# EAGLE design ArrayC_v3zp (EAGLE 7.5.0)
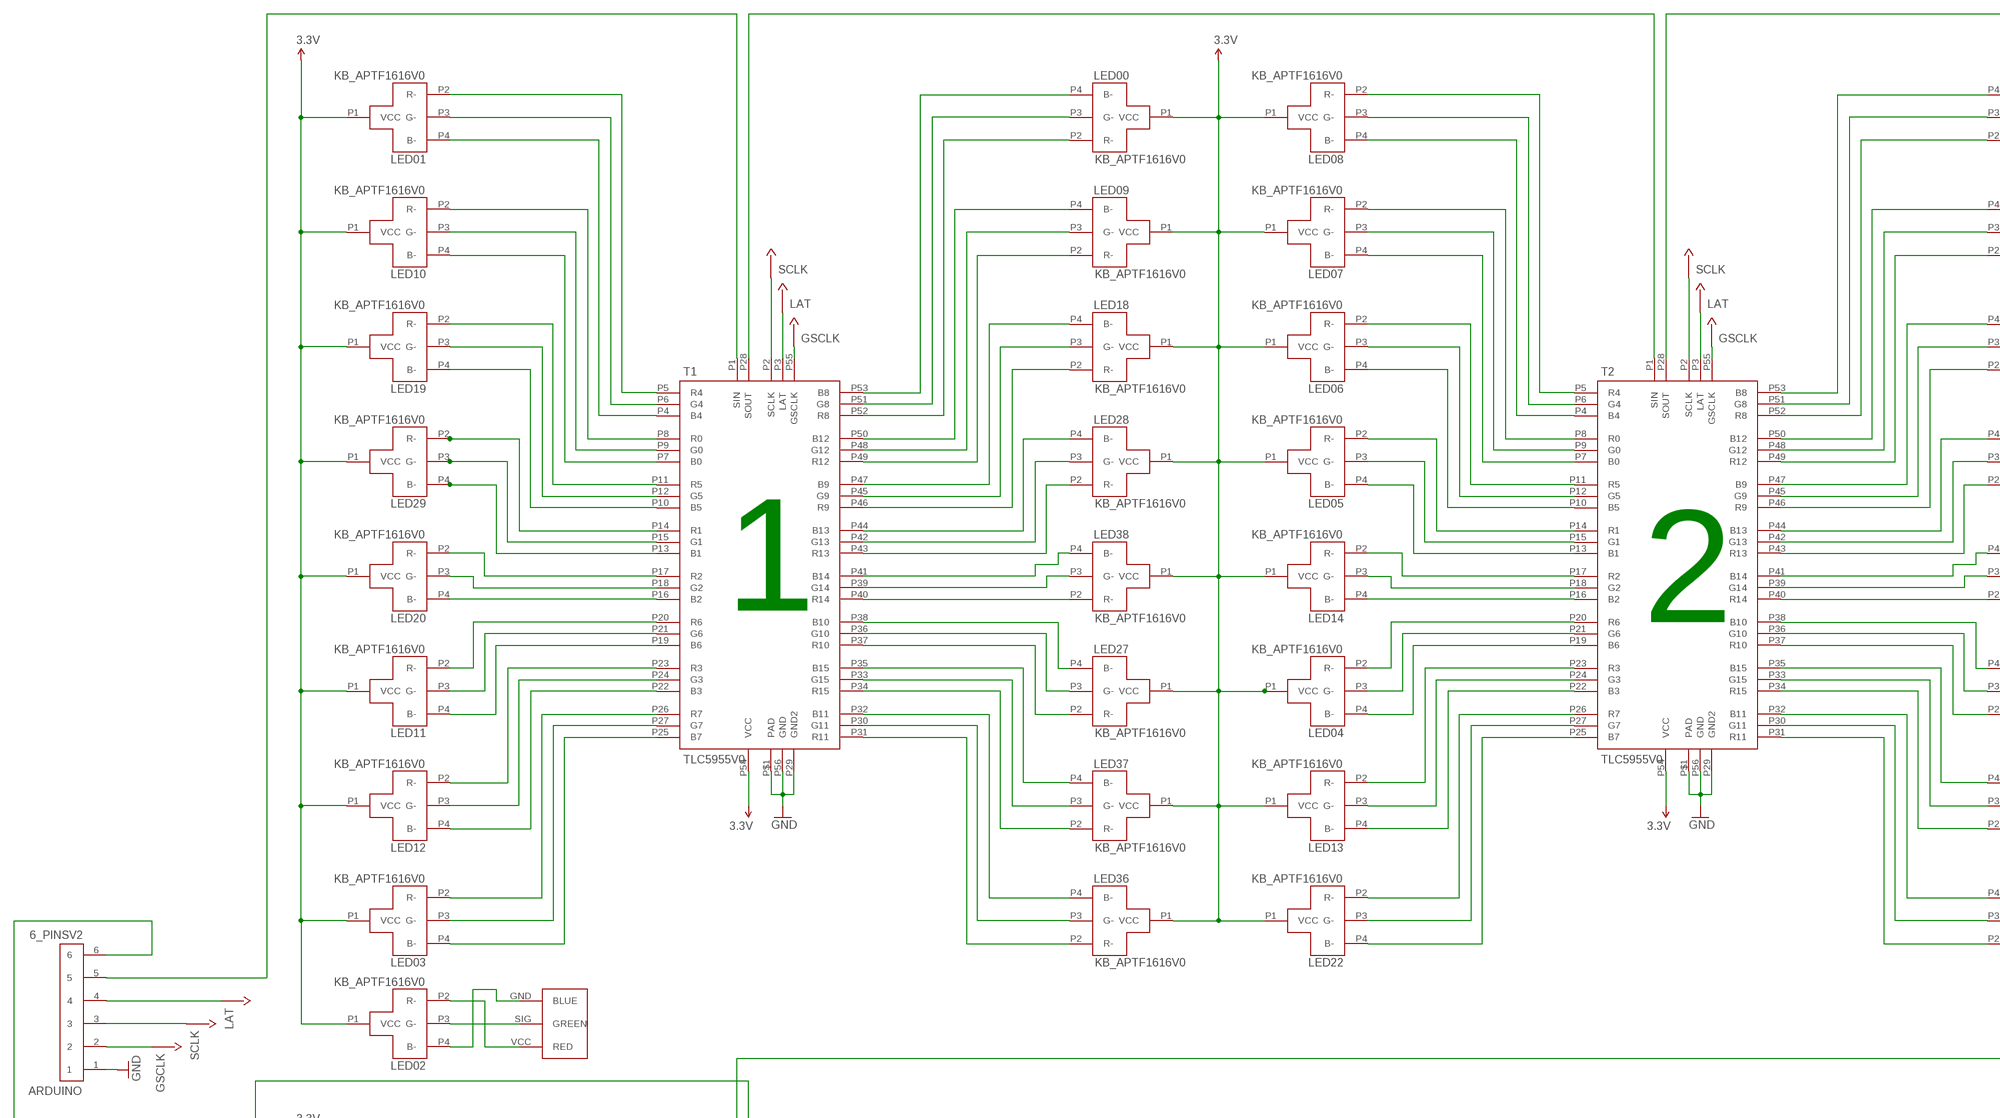
[diagram p0: schematic, sheet 1, part 1 of 3]
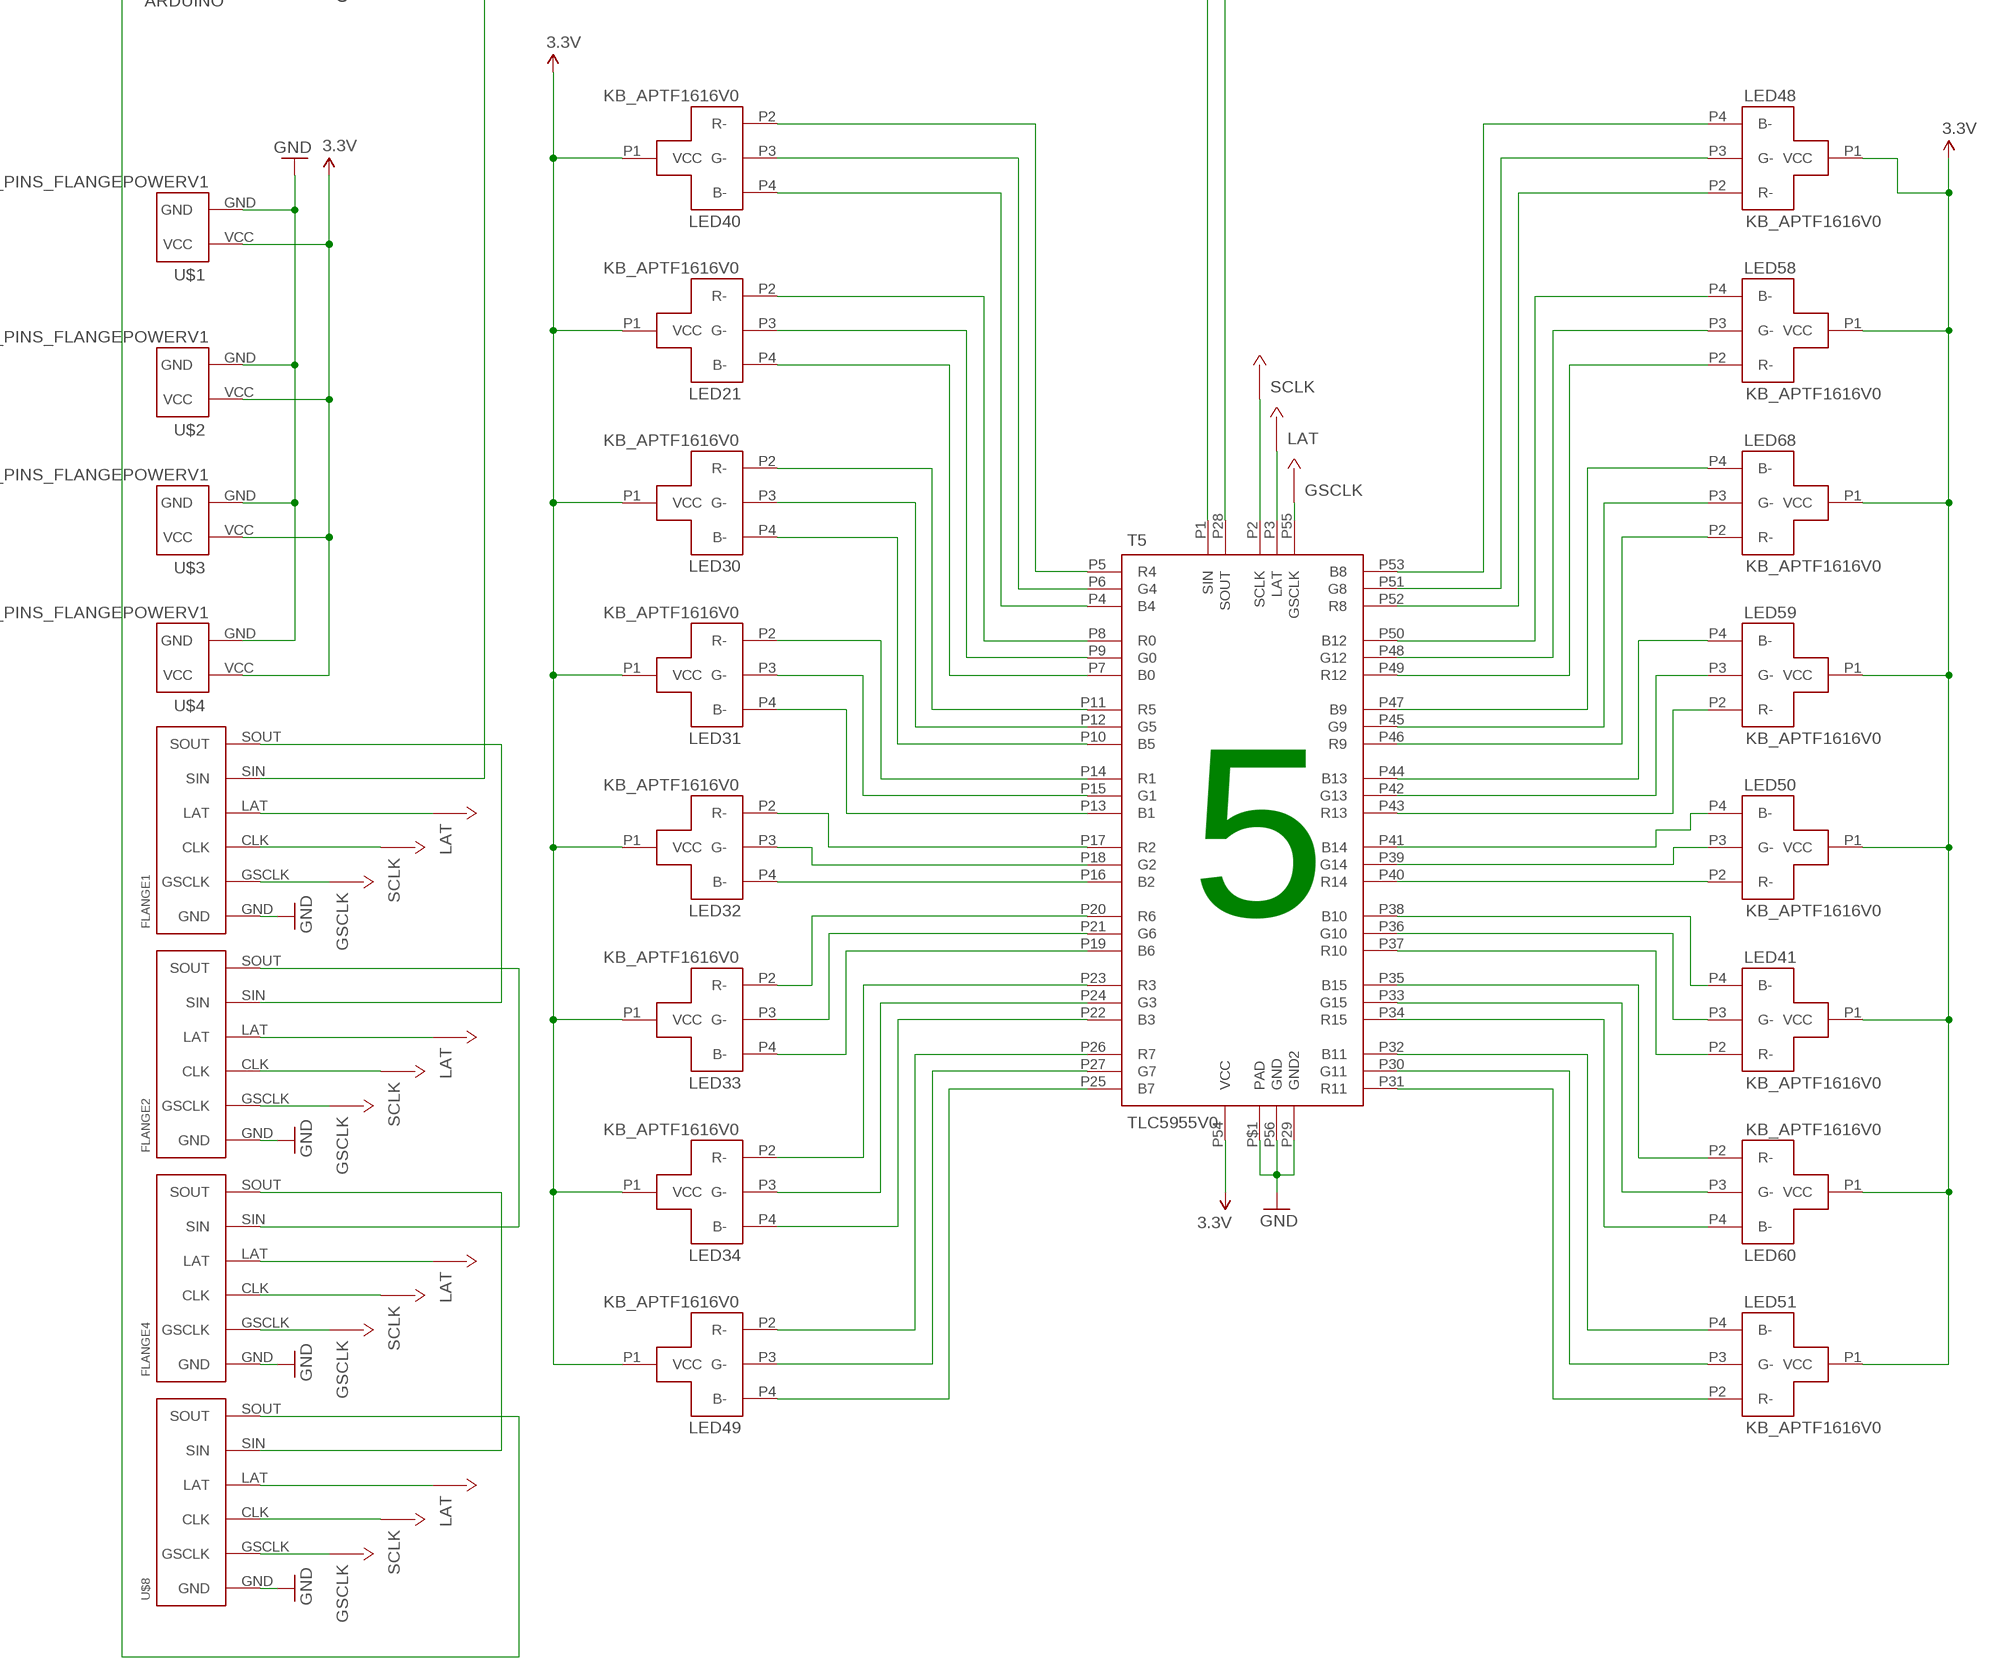
[diagram p1: schematic, sheet 1, part 2 of 3]
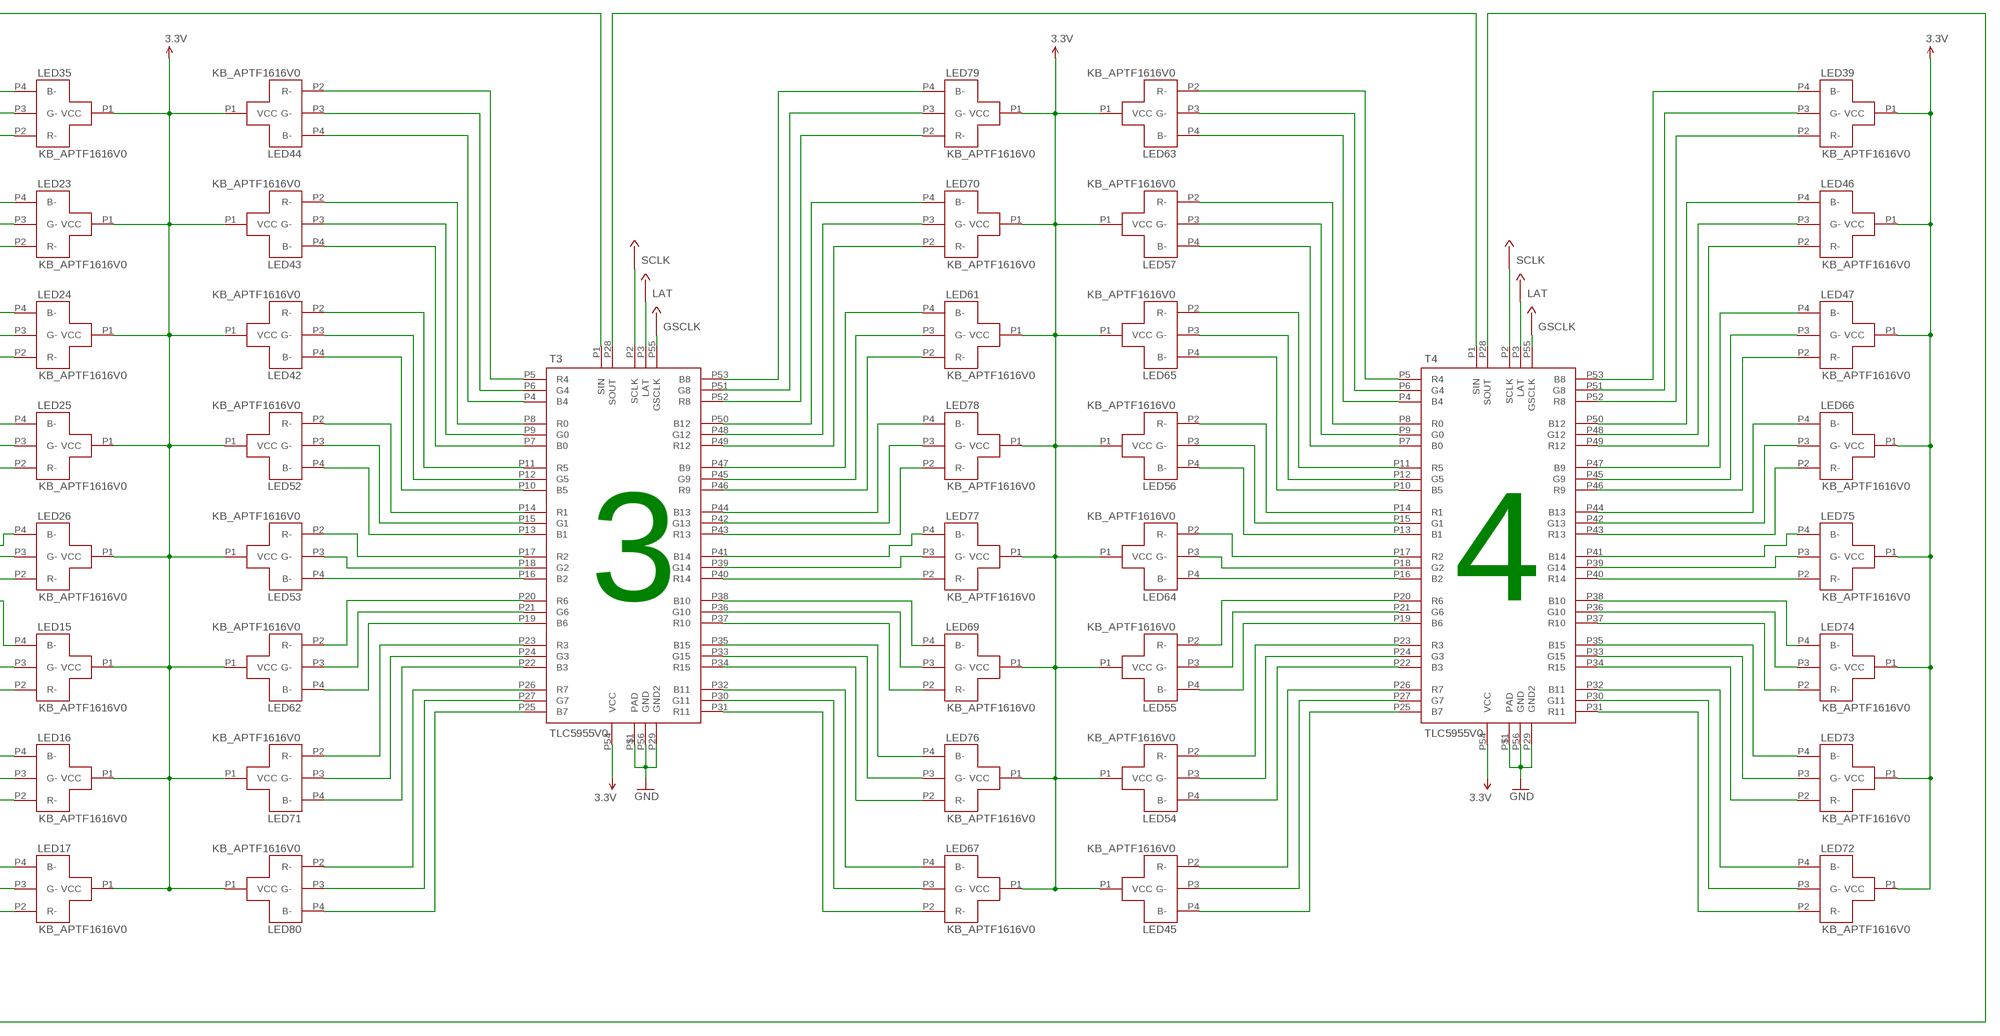
[diagram p2: schematic, sheet 1, part 3 of 3]

## Parts
ARDUINO  6_PINSV2  [6PIN_SMD]
FLANGE1  6PINS_LEDFLANGEV1  [6PIN_PADS]
FLANGE2  6PINS_LEDFLANGEV1  [6PIN_PADS]
FLANGE4  6PINS_LEDFLANGEV1  [6PIN_PADS]
LED  3_PINS_RGBV1  [3PIN_HOLES]
LED00  KB_APTF1616V0  [KB_RGBLED_APTF1616]
LED01  KB_APTF1616V0  [KB_RGBLED_APTF1616]
LED02  KB_APTF1616V0  [KB_RGBLED_APTF1616]
LED03  KB_APTF1616V0  [KB_RGBLED_APTF1616]
LED04  KB_APTF1616V0  [KB_RGBLED_APTF1616]
LED05  KB_APTF1616V0  [KB_RGBLED_APTF1616]
LED06  KB_APTF1616V0  [KB_RGBLED_APTF1616]
LED07  KB_APTF1616V0  [KB_RGBLED_APTF1616]
LED08  KB_APTF1616V0  [KB_RGBLED_APTF1616]
LED09  KB_APTF1616V0  [KB_RGBLED_APTF1616]
LED10  KB_APTF1616V0  [KB_RGBLED_APTF1616]
LED11  KB_APTF1616V0  [KB_RGBLED_APTF1616]
LED12  KB_APTF1616V0  [KB_RGBLED_APTF1616]
LED13  KB_APTF1616V0  [KB_RGBLED_APTF1616]
LED14  KB_APTF1616V0  [KB_RGBLED_APTF1616]
LED15  KB_APTF1616V0  [KB_RGBLED_APTF1616]
LED16  KB_APTF1616V0  [KB_RGBLED_APTF1616]
LED17  KB_APTF1616V0  [KB_RGBLED_APTF1616]
LED18  KB_APTF1616V0  [KB_RGBLED_APTF1616]
LED19  KB_APTF1616V0  [KB_RGBLED_APTF1616]
LED20  KB_APTF1616V0  [KB_RGBLED_APTF1616]
LED21  KB_APTF1616V0  [KB_RGBLED_APTF1616]
LED22  KB_APTF1616V0  [KB_RGBLED_APTF1616]
LED23  KB_APTF1616V0  [KB_RGBLED_APTF1616]
LED24  KB_APTF1616V0  [KB_RGBLED_APTF1616]
LED25  KB_APTF1616V0  [KB_RGBLED_APTF1616]
LED26  KB_APTF1616V0  [KB_RGBLED_APTF1616]
LED27  KB_APTF1616V0  [KB_RGBLED_APTF1616]
LED28  KB_APTF1616V0  [KB_RGBLED_APTF1616]
LED29  KB_APTF1616V0  [KB_RGBLED_APTF1616]
LED30  KB_APTF1616V0  [KB_RGBLED_APTF1616]
LED31  KB_APTF1616V0  [KB_RGBLED_APTF1616]
LED32  KB_APTF1616V0  [KB_RGBLED_APTF1616]
LED33  KB_APTF1616V0  [KB_RGBLED_APTF1616]
LED34  KB_APTF1616V0  [KB_RGBLED_APTF1616]
LED35  KB_APTF1616V0  [KB_RGBLED_APTF1616]
LED36  KB_APTF1616V0  [KB_RGBLED_APTF1616]
LED37  KB_APTF1616V0  [KB_RGBLED_APTF1616]
LED38  KB_APTF1616V0  [KB_RGBLED_APTF1616]
LED39  KB_APTF1616V0  [KB_RGBLED_APTF1616]
LED40  KB_APTF1616V0  [KB_RGBLED_APTF1616]
LED41  KB_APTF1616V0  [KB_RGBLED_APTF1616]
LED42  KB_APTF1616V0  [KB_RGBLED_APTF1616]
LED43  KB_APTF1616V0  [KB_RGBLED_APTF1616]
LED44  KB_APTF1616V0  [KB_RGBLED_APTF1616]
LED45  KB_APTF1616V0  [KB_RGBLED_APTF1616]
LED46  KB_APTF1616V0  [KB_RGBLED_APTF1616]
LED47  KB_APTF1616V0  [KB_RGBLED_APTF1616]
LED48  KB_APTF1616V0  [KB_RGBLED_APTF1616]
LED49  KB_APTF1616V0  [KB_RGBLED_APTF1616]
LED50  KB_APTF1616V0  [KB_RGBLED_APTF1616]
LED51  KB_APTF1616V0  [KB_RGBLED_APTF1616]
LED52  KB_APTF1616V0  [KB_RGBLED_APTF1616]
LED53  KB_APTF1616V0  [KB_RGBLED_APTF1616]
LED54  KB_APTF1616V0  [KB_RGBLED_APTF1616]
LED55  KB_APTF1616V0  [KB_RGBLED_APTF1616]
LED56  KB_APTF1616V0  [KB_RGBLED_APTF1616]
LED57  KB_APTF1616V0  [KB_RGBLED_APTF1616]
LED58  KB_APTF1616V0  [KB_RGBLED_APTF1616]
LED59  KB_APTF1616V0  [KB_RGBLED_APTF1616]
LED60  KB_APTF1616V0  [KB_RGBLED_APTF1616]
LED61  KB_APTF1616V0  [KB_RGBLED_APTF1616]
LED62  KB_APTF1616V0  [KB_RGBLED_APTF1616]
LED63  KB_APTF1616V0  [KB_RGBLED_APTF1616]
LED64  KB_APTF1616V0  [KB_RGBLED_APTF1616]
LED65  KB_APTF1616V0  [KB_RGBLED_APTF1616]
LED66  KB_APTF1616V0  [KB_RGBLED_APTF1616]
LED67  KB_APTF1616V0  [KB_RGBLED_APTF1616]
LED68  KB_APTF1616V0  [KB_RGBLED_APTF1616]
LED69  KB_APTF1616V0  [KB_RGBLED_APTF1616]
LED70  KB_APTF1616V0  [KB_RGBLED_APTF1616]
LED71  KB_APTF1616V0  [KB_RGBLED_APTF1616]
LED72  KB_APTF1616V0  [KB_RGBLED_APTF1616]
LED73  KB_APTF1616V0  [KB_RGBLED_APTF1616]
LED74  KB_APTF1616V0  [KB_RGBLED_APTF1616]
LED75  KB_APTF1616V0  [KB_RGBLED_APTF1616]
LED76  KB_APTF1616V0  [KB_RGBLED_APTF1616]
LED77  KB_APTF1616V0  [KB_RGBLED_APTF1616]
LED78  KB_APTF1616V0  [KB_RGBLED_APTF1616]
LED79  KB_APTF1616V0  [KB_RGBLED_APTF1616]
LED80  KB_APTF1616V0  [KB_RGBLED_APTF1616]
T1  TLC5955V0  [56-HTSSOP]
T2  TLC5955V0  [56-HTSSOP]
T3  TLC5955V0  [56-HTSSOP]
T4  TLC5955V0  [56-HTSSOP]
T5  TLC5955V0  [56-HTSSOP]
U$1  2_PINS_FLANGEPOWERV1  [2PIN_PADS_PWR]
U$2  2_PINS_FLANGEPOWERV1  [2PIN_PADS_PWR]
U$3  2_PINS_FLANGEPOWERV1  [2PIN_PADS_PWR]
U$4  2_PINS_FLANGEPOWERV1  [2PIN_PADS_PWR]
U$8  6PINS_LEDFLANGEV1  [6PIN_PADS]

## Nets
3.3V: LED01.P1(VCC) LED02.P1(VCC) LED03.P1(VCC) LED10.P1(VCC) LED11.P1(VCC) LED12.P1(VCC) LED19.P1(VCC) LED20.P1(VCC) LED21.P1(VCC) LED29.P1(VCC) LED30.P1(VCC) LED31.P1(VCC) LED32.P1(VCC) LED33.P1(VCC) LED34.P1(VCC) LED39.P1(VCC) LED40.P1(VCC) LED41.P1(VCC) LED45.P1(VCC) LED46.P1(VCC) LED47.P1(VCC) LED48.P1(VCC) LED49.P1(VCC) LED50.P1(VCC) LED51.P1(VCC) LED54.P1(VCC) LED55.P1(VCC) LED56.P1(VCC) LED57.P1(VCC) LED58.P1(VCC) LED59.P1(VCC) LED60.P1(VCC) LED61.P1(VCC) LED63.P1(VCC) LED64.P1(VCC) LED65.P1(VCC) LED66.P1(VCC) LED67.P1(VCC) LED68.P1(VCC) LED69.P1(VCC) LED70.P1(VCC) LED72.P1(VCC) LED73.P1(VCC) LED74.P1(VCC) LED75.P1(VCC) LED76.P1(VCC) LED77.P1(VCC) LED78.P1(VCC) LED79.P1(VCC) T1.P54(VCC) T2.P54(VCC) T3.P54(VCC) T4.P54(VCC) T5.P54(VCC) U$1.VCC U$2.VCC U$3.VCC U$4.VCC
GND: ARDUINO.1 FLANGE1.GND FLANGE2.GND FLANGE4.GND T1.P29(GND2) T1.P56(GND) T1.P$1(PAD) T2.P29(GND2) T2.P56(GND) T2.P$1(PAD) T3.P29(GND2) T3.P56(GND) T3.P$1(PAD) T4.P29(GND2) T4.P56(GND) T4.P$1(PAD) T5.P29(GND2) T5.P56(GND) T5.P$1(PAD) U$1.GND U$2.GND U$3.GND U$4.GND U$8.GND
GSCLK: ARDUINO.2 FLANGE1.GSCLK FLANGE2.GSCLK FLANGE4.GSCLK T1.P55(GSCLK) T2.P55(GSCLK) T3.P55(GSCLK) T4.P55(GSCLK) T5.P55(GSCLK) U$8.GSCLK
LAT: ARDUINO.4 FLANGE1.LAT FLANGE2.LAT FLANGE4.LAT T1.P3(LAT) T2.P3(LAT) T3.P3(LAT) T4.P3(LAT) T5.P3(LAT) U$8.LAT
N$1: LED40.P2(R-) T5.P5(R4)
N$2: LED40.P3(G-) T5.P6(G4)
N$3: LED40.P4(B-) T5.P4(B4)
N$4: LED21.P2(R-) T5.P8(R0)
N$5: LED21.P3(G-) T5.P9(G0)
N$6: LED21.P4(B-) T5.P7(B0)
N$7: LED30.P2(R-) T5.P11(R5)
N$8: LED30.P3(G-) T5.P12(G5)
N$9: LED30.P4(B-) T5.P10(B5)
N$10: LED31.P2(R-) T5.P14(R1)
N$11: LED31.P3(G-) T5.P15(G1)
N$12: LED31.P4(B-) T5.P13(B1)
N$13: LED32.P2(R-) T5.P17(R2)
N$14: LED32.P3(G-) T5.P18(G2)
N$15: LED32.P4(B-) T5.P16(B2)
N$16: LED33.P2(R-) T5.P20(R6)
N$17: LED33.P3(G-) T5.P21(G6)
N$18: LED33.P4(B-) T5.P19(B6)
N$19: LED34.P2(R-) T5.P23(R3)
N$20: LED34.P3(G-) T5.P24(G3)
N$21: LED34.P4(B-) T5.P22(B3)
N$22: LED49.P2(R-) T5.P26(R7)
N$23: LED49.P3(G-) T5.P27(G7)
N$24: LED49.P4(B-) T5.P25(B7)
N$25: LED48.P4(B-) T5.P53(B8)
N$26: LED48.P3(G-) T5.P51(G8)
N$27: LED48.P2(R-) T5.P52(R8)
N$28: LED58.P4(B-) T5.P50(B12)
N$29: LED58.P3(G-) T5.P48(G12)
N$30: LED58.P2(R-) T5.P49(R12)
N$31: LED68.P4(B-) T5.P47(B9)
N$32: LED68.P3(G-) T5.P45(G9)
N$33: LED68.P2(R-) T5.P46(R9)
N$34: LED59.P4(B-) T5.P44(B13)
N$35: LED59.P3(G-) T5.P42(G13)
N$36: LED50.P4(B-) T5.P41(B14)
N$37: LED50.P3(G-) T5.P39(G14)
N$38: LED50.P2(R-) T5.P40(R14)
N$39: LED41.P4(B-) T5.P38(B10)
N$40: LED41.P3(G-) T5.P36(G10)
N$41: LED41.P2(R-) T5.P37(R10)
N$42: LED60.P2(R-) T5.P35(B15)
N$43: LED60.P3(G-) T5.P33(G15)
N$44: LED60.P4(B-) T5.P34(R15)
N$45: LED51.P4(B-) T5.P32(B11)
N$46: LED51.P3(G-) T5.P30(G11)
N$47: LED51.P2(R-) T5.P31(R11)
N$49: LED02.P2(R-) LED.VCC(RED)
N$50: LED02.P4(B-) LED.GND(BLUE)
N$51: LED02.P3(G-) LED.SIG(GREEN)
N$52: FLANGE1.SOUT FLANGE2.SIN
N$53: FLANGE2.SOUT FLANGE4.SIN
N$54: ARDUINO.6 U$8.SOUT
N$55: FLANGE4.SOUT U$8.SIN
N$95: LED01.P2(R-) T1.P5(R4)
N$96: LED01.P3(G-) T1.P6(G4)
N$97: LED01.P4(B-) T1.P4(B4)
N$98: LED10.P2(R-) T1.P8(R0)
N$99: LED10.P3(G-) T1.P9(G0)
N$100: LED10.P4(B-) T1.P7(B0)
N$101: LED19.P2(R-) T1.P11(R5)
N$102: LED19.P3(G-) T1.P12(G5)
N$103: LED19.P4(B-) T1.P10(B5)
N$104: LED29.P2(R-) T1.P14(R1)
N$105: LED29.P3(G-) T1.P15(G1)
N$106: LED29.P4(B-) T1.P13(B1)
N$107: LED20.P2(R-) T1.P17(R2)
N$108: LED20.P3(G-) T1.P18(G2)
N$109: LED20.P4(B-) T1.P16(B2)
N$110: LED11.P2(R-) T1.P20(R6)
N$111: LED11.P3(G-) T1.P21(G6)
N$112: LED11.P4(B-) T1.P19(B6)
N$113: LED12.P2(R-) T1.P23(R3)
N$114: LED12.P3(G-) T1.P24(G3)
N$115: LED12.P4(B-) T1.P22(B3)
N$116: LED03.P2(R-) T1.P26(R7)
N$117: LED03.P3(G-) T1.P27(G7)
N$118: LED03.P4(B-) T1.P25(B7)
N$119: LED00.P4(B-) T1.P53(B8)
N$120: LED00.P3(G-) T1.P51(G8)
N$121: LED00.P2(R-) T1.P52(R8)
N$122: LED09.P4(B-) T1.P50(B12)
N$123: LED09.P3(G-) T1.P48(G12)
N$124: LED09.P2(R-) T1.P49(R12)
N$125: LED18.P4(B-) T1.P47(B9)
N$126: LED18.P3(G-) T1.P45(G9)
N$127: LED18.P2(R-) T1.P46(R9)
N$128: LED28.P4(B-) T1.P44(B13)
N$129: LED28.P3(G-) T1.P42(G13)
N$130: LED38.P4(B-) T1.P41(B14)
N$131: LED38.P3(G-) T1.P39(G14)
N$132: LED38.P2(R-) T1.P40(R14)
N$133: LED27.P4(B-) T1.P38(B10)
N$134: LED27.P3(G-) T1.P36(G10)
N$135: LED27.P2(R-) T1.P37(R10)
N$136: LED37.P4(B-) T1.P35(B15)
N$137: LED37.P3(G-) T1.P33(G15)
N$138: LED37.P2(R-) T1.P34(R15)
N$139: LED36.P4(B-) T1.P32(B11)
N$140: LED36.P3(G-) T1.P30(G11)
N$141: LED36.P2(R-) T1.P31(R11)
N$142: LED44.P2(R-) T3.P5(R4)
N$143: LED08.P2(R-) T2.P5(R4)
N$144: LED08.P3(G-) T2.P6(G4)
N$145: LED08.P4(B-) T2.P4(B4)
N$146: LED07.P2(R-) T2.P8(R0)
N$147: LED07.P3(G-) T2.P9(G0)
N$148: LED07.P4(B-) T2.P7(B0)
N$149: LED06.P2(R-) T2.P11(R5)
N$150: LED06.P3(G-) T2.P12(G5)
N$151: LED06.P4(B-) T2.P10(B5)
N$152: LED05.P2(R-) T2.P14(R1)
N$153: LED05.P3(G-) T2.P15(G1)
N$154: LED05.P4(B-) T2.P13(B1)
N$155: LED14.P2(R-) T2.P17(R2)
N$156: LED14.P3(G-) T2.P18(G2)
N$157: LED14.P4(B-) T2.P16(B2)
N$158: LED04.P2(R-) T2.P20(R6)
N$159: LED04.P3(G-) T2.P21(G6)
N$160: LED04.P4(B-) T2.P19(B6)
N$161: LED13.P2(R-) T2.P23(R3)
N$162: LED13.P3(G-) T2.P24(G3)
N$163: LED13.P4(B-) T2.P22(B3)
N$164: LED22.P2(R-) T2.P26(R7)
N$165: LED22.P3(G-) T2.P27(G7)
N$166: LED22.P4(B-) T2.P25(B7)
N$167: LED35.P4(B-) T2.P53(B8)
N$168: LED35.P3(G-) T2.P51(G8)
N$169: LED35.P2(R-) T2.P52(R8)
N$170: LED23.P4(B-) T2.P50(B12)
N$171: LED23.P3(G-) T2.P48(G12)
N$172: LED23.P2(R-) T2.P49(R12)
N$173: LED24.P4(B-) T2.P47(B9)
N$174: LED24.P3(G-) T2.P45(G9)
N$175: LED24.P2(R-) T2.P46(R9)
N$176: LED25.P4(B-) T2.P44(B13)
N$177: LED25.P3(G-) T2.P42(G13)
N$178: LED26.P4(B-) T2.P41(B14)
N$179: LED26.P3(G-) T2.P39(G14)
N$180: LED26.P2(R-) T2.P40(R14)
N$181: LED15.P4(B-) T2.P38(B10)
N$182: LED15.P3(G-) T2.P36(G10)
N$183: LED15.P2(R-) T2.P37(R10)
N$184: LED16.P4(B-) T2.P35(B15)
N$185: LED16.P3(G-) T2.P33(G15)
N$186: LED16.P2(R-) T2.P34(R15)
N$187: LED17.P4(B-) T2.P32(B11)
N$188: LED17.P3(G-) T2.P30(G11)
N$189: LED17.P2(R-) T2.P31(R11)
N$190: LED44.P3(G-) T3.P6(G4)
N$191: LED44.P4(B-) T3.P4(B4)
N$192: LED43.P2(R-) T3.P8(R0)
N$193: LED43.P3(G-) T3.P9(G0)
N$194: LED43.P4(B-) T3.P7(B0)
N$195: LED42.P2(R-) T3.P11(R5)
N$196: LED42.P3(G-) T3.P12(G5)
N$197: LED42.P4(B-) T3.P10(B5)
N$198: LED52.P2(R-) T3.P14(R1)
N$199: LED52.P3(G-) T3.P15(G1)
N$200: LED52.P4(B-) T3.P13(B1)
N$201: LED53.P2(R-) T3.P17(R2)
N$202: LED53.P3(G-) T3.P18(G2)
N$203: LED53.P4(B-) T3.P16(B2)
N$204: LED62.P2(R-) T3.P20(R6)
N$205: LED62.P3(G-) T3.P21(G6)
N$206: LED62.P4(B-) T3.P19(B6)
N$207: LED71.P2(R-) T3.P23(R3)
N$208: LED71.P3(G-) T3.P24(G3)
N$209: LED71.P4(B-) T3.P22(B3)
N$210: LED80.P2(R-) T3.P26(R7)
N$211: LED80.P3(G-) T3.P27(G7)
N$212: LED80.P4(B-) T3.P25(B7)
N$213: LED79.P4(B-) T3.P53(B8)
N$214: LED79.P3(G-) T3.P51(G8)
N$215: LED79.P2(R-) T3.P52(R8)
N$216: LED70.P4(B-) T3.P50(B12)
N$217: LED70.P3(G-) T3.P48(G12)
N$218: LED70.P2(R-) T3.P49(R12)
N$219: LED61.P4(B-) T3.P47(B9)
N$220: LED61.P3(G-) T3.P45(G9)
N$221: LED61.P2(R-) T3.P46(R9)
N$222: LED78.P4(B-) T3.P44(B13)
N$223: LED78.P3(G-) T3.P42(G13)
N$224: LED77.P4(B-) T3.P41(B14)
N$225: LED77.P3(G-) T3.P39(G14)
N$226: LED77.P2(R-) T3.P40(R14)
N$227: LED69.P4(B-) T3.P38(B10)
N$228: LED69.P3(G-) T3.P36(G10)
N$229: LED69.P2(R-) T3.P37(R10)
N$230: LED76.P4(B-) T3.P35(B15)
N$231: LED76.P3(G-) T3.P33(G15)
N$232: LED76.P2(R-) T3.P34(R15)
N$233: LED67.P4(B-) T3.P32(B11)
N$234: LED67.P3(G-) T3.P30(G11)
N$235: LED67.P2(R-) T3.P31(R11)
N$283: LED63.P2(R-) T4.P5(R4)
N$284: LED63.P3(G-) T4.P6(G4)
N$285: LED63.P4(B-) T4.P4(B4)
N$286: LED57.P2(R-) T4.P8(R0)
N$287: LED57.P3(G-) T4.P9(G0)
N$288: LED57.P4(B-) T4.P7(B0)
N$289: LED65.P2(R-) T4.P11(R5)
N$290: LED65.P3(G-) T4.P12(G5)
N$291: LED65.P4(B-) T4.P10(B5)
N$292: LED56.P2(R-) T4.P14(R1)
N$293: LED56.P3(G-) T4.P15(G1)
N$294: LED56.P4(B-) T4.P13(B1)
N$295: LED64.P2(R-) T4.P17(R2)
N$296: LED64.P3(G-) T4.P18(G2)
N$297: LED64.P4(B-) T4.P16(B2)
N$298: LED55.P2(R-) T4.P20(R6)
N$299: LED55.P3(G-) T4.P21(G6)
N$300: LED55.P4(B-) T4.P19(B6)
N$301: LED54.P2(R-) T4.P23(R3)
N$302: LED54.P3(G-) T4.P24(G3)
N$303: LED54.P4(B-) T4.P22(B3)
N$304: LED45.P2(R-) T4.P26(R7)
N$305: LED45.P3(G-) T4.P27(G7)
N$306: LED45.P4(B-) T4.P25(B7)
N$307: LED39.P4(B-) T4.P53(B8)
N$308: LED39.P3(G-) T4.P51(G8)
N$309: LED39.P2(R-) T4.P52(R8)
N$310: LED46.P4(B-) T4.P50(B12)
N$311: LED46.P3(G-) T4.P48(G12)
N$312: LED46.P2(R-) T4.P49(R12)
N$313: LED47.P4(B-) T4.P47(B9)
N$314: LED47.P3(G-) T4.P45(G9)
N$315: LED47.P2(R-) T4.P46(R9)
N$316: LED66.P4(B-) T4.P44(B13)
N$317: LED66.P3(G-) T4.P42(G13)
N$318: LED75.P4(B-) T4.P41(B14)
N$319: LED75.P3(G-) T4.P39(G14)
N$320: LED75.P2(R-) T4.P40(R14)
N$321: LED74.P4(B-) T4.P38(B10)
N$322: LED74.P3(G-) T4.P36(G10)
N$323: LED74.P2(R-) T4.P37(R10)
N$324: LED73.P4(B-) T4.P35(B15)
N$325: LED73.P3(G-) T4.P33(G15)
N$326: LED73.P2(R-) T4.P34(R15)
N$327: LED72.P4(B-) T4.P32(B11)
N$328: LED72.P3(G-) T4.P30(G11)
N$329: LED72.P2(R-) T4.P31(R11)
N$357: FLANGE1.SIN T5.P28(SOUT)
N$360: T4.P28(SOUT) T5.P1(SIN)
N$361: T3.P28(SOUT) T4.P1(SIN)
N$362: T2.P28(SOUT) T3.P1(SIN)
N$363: T1.P28(SOUT) T2.P1(SIN)
N$364: LED66.P2(R-) T4.P43(R13)
N$365: ARDUINO.5 T1.P1(SIN)
N$370: LED59.P2(R-) T5.P43(R13)
N$372: LED78.P2(R-) T3.P43(R13)
N$373: LED25.P2(R-) T2.P43(R13)
N$374: LED00.P1(VCC) LED04.P1(VCC) LED05.P1(VCC) LED06.P1(VCC) LED07.P1(VCC) LED08.P1(VCC) LED09.P1(VCC) LED13.P1(VCC) LED14.P1(VCC) LED18.P1(VCC) LED22.P1(VCC) LED27.P1(VCC) LED28.P1(VCC) LED36.P1(VCC) LED37.P1(VCC) LED38.P1(VCC)
N$375: LED28.P2(R-) T1.P43(R13)
N$384: LED15.P1(VCC) LED16.P1(VCC) LED17.P1(VCC) LED23.P1(VCC) LED24.P1(VCC) LED25.P1(VCC) LED26.P1(VCC) LED35.P1(VCC) LED42.P1(VCC) LED43.P1(VCC) LED44.P1(VCC) LED52.P1(VCC) LED53.P1(VCC) LED62.P1(VCC) LED71.P1(VCC) LED80.P1(VCC)
SCLK: ARDUINO.3 FLANGE1.CLK FLANGE2.CLK FLANGE4.CLK T1.P2(SCLK) T2.P2(SCLK) T3.P2(SCLK) T4.P2(SCLK) T5.P2(SCLK) U$8.CLK

## Notes on the sheet
- 1 | 2 | 3 | 4
- 5

## Library data of the parts
ARDUINO = WallerLabLib:6_PINS
FLANGE1 FLANGE2 FLANGE4 U$8 = WallerLabLib:6PINS_LEDFLANGE
LED = WallerLabLib:3_PINS_RGB
LED00 LED01-LED09 LED10-LED80 = WallerLabLib:KB_APTF1616
T1-T5 = WallerLabLib:TLC5955
U$1-U$4 = WallerLabLib:2_PINS_FLANGEPOWER

## Board
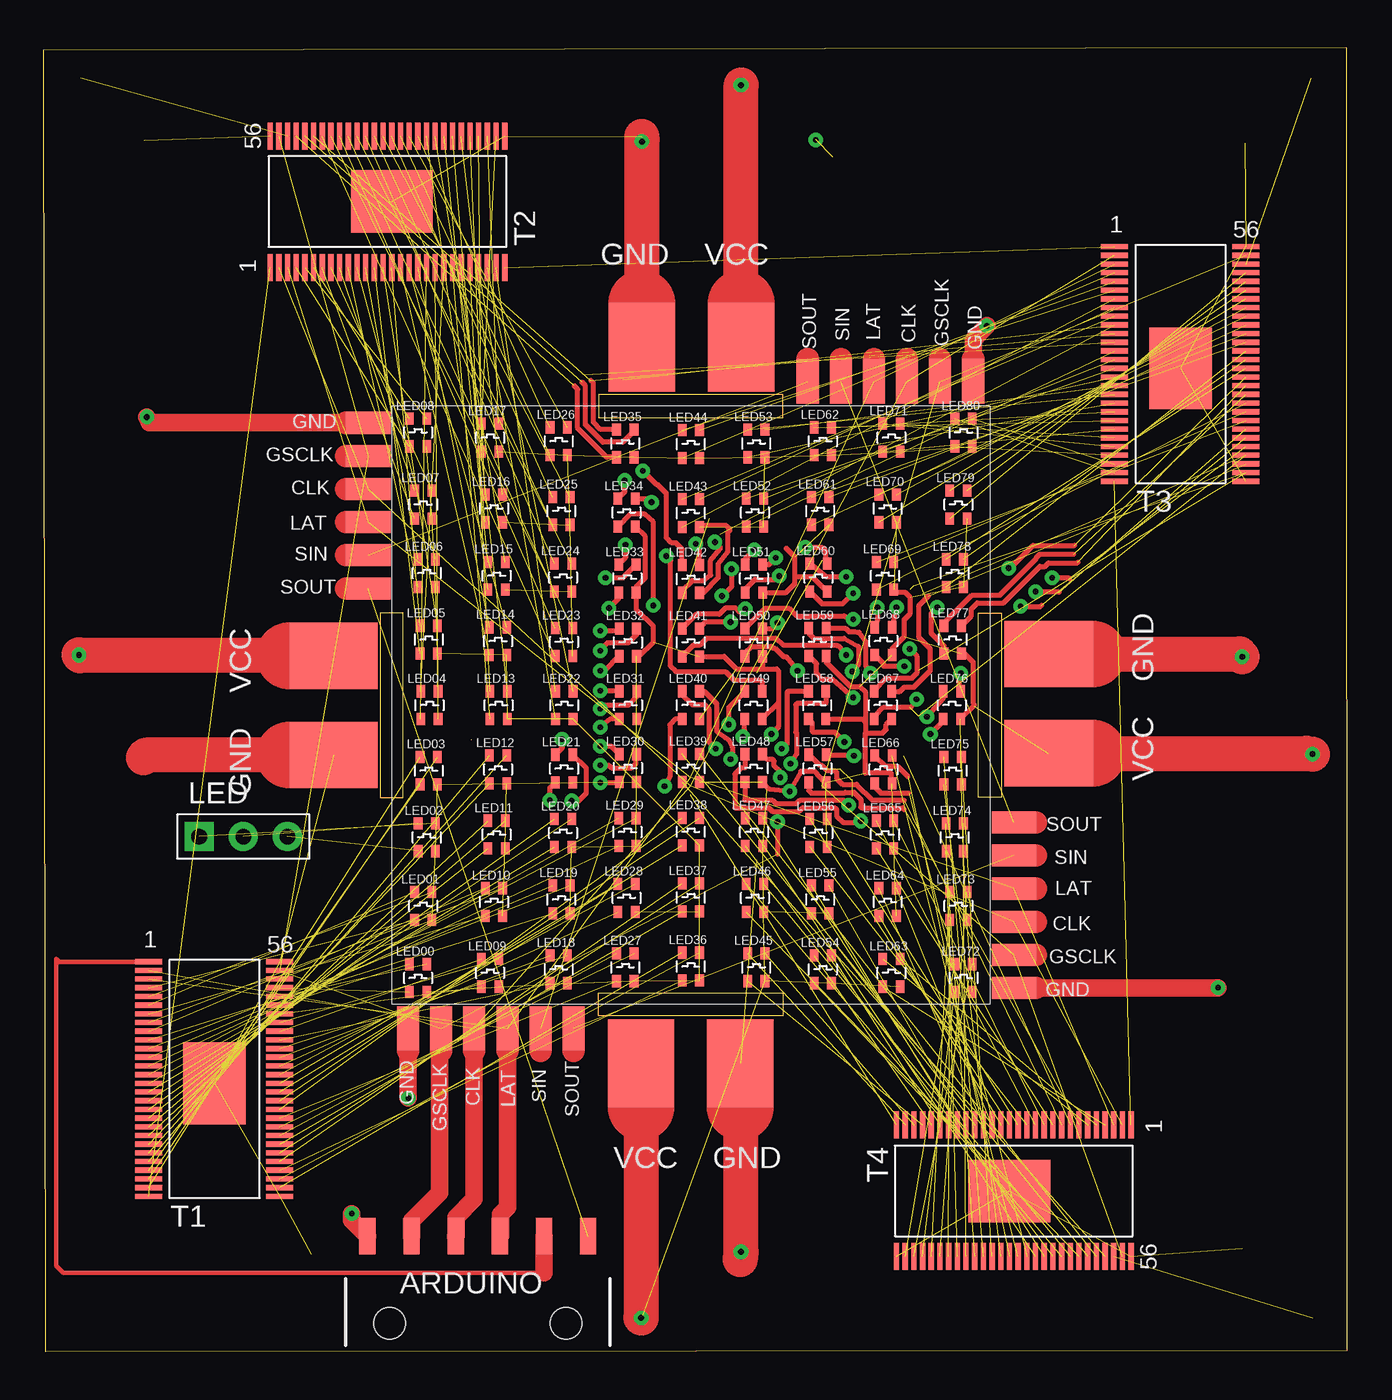
[diagram p3: board, top side]
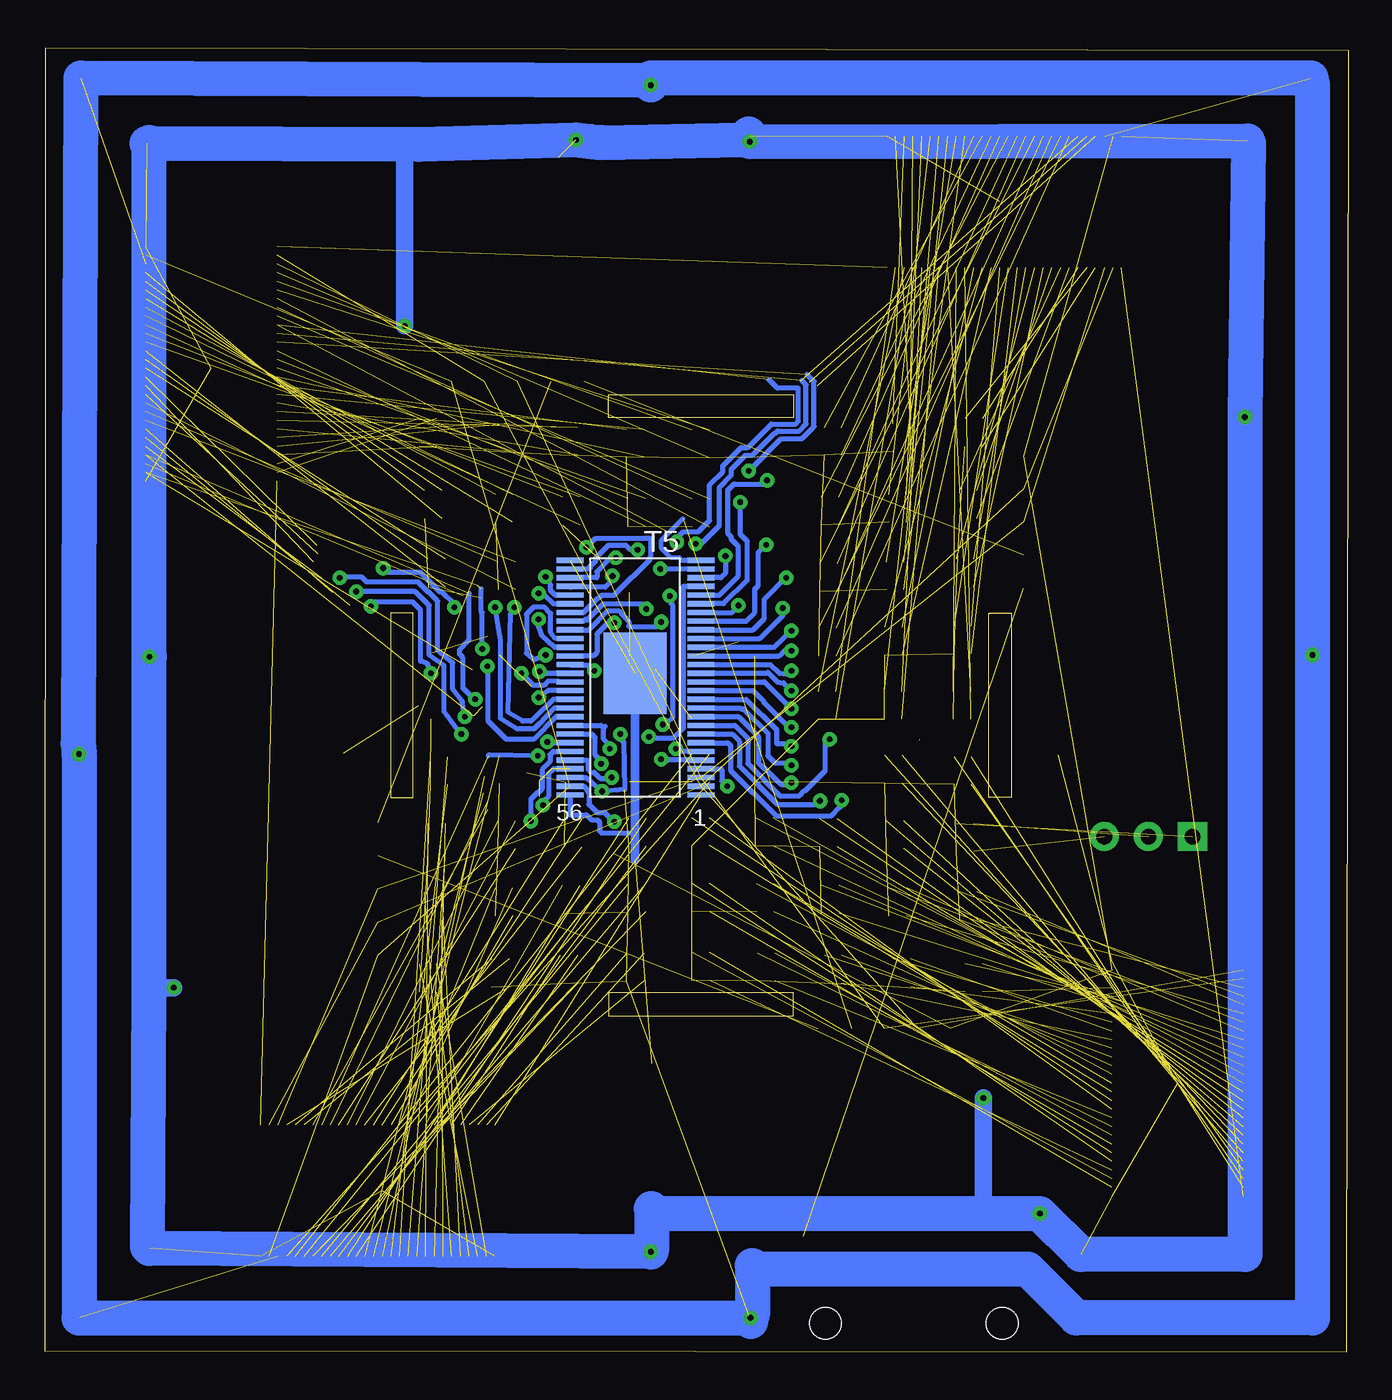
[diagram p4: board, bottom side, seen from below]

Size 75.02 x 75.05 mm. Coordinates in mm from the lower left corner, seen from the top.
Outline: 24.65,35.2 24.65,35.25
Outline: 53.83,42.53 55.13,42.53 55.13,31.89 53.83,31.89 53.83,42.53
Outline: 75,75.05 75.02,0.05 0.1,0 0,74.92 75,75.05
Outline: 42.58,53.78 42.58,55.08 31.94,55.08 31.94,53.78 42.58,53.78
Outline: 20.69,42.53 19.38,42.53 19.38,31.89 20.69,31.89 20.69,42.53
Outline: 42.58,20.64 42.58,19.33 31.94,19.33 31.94,20.64 42.58,20.64
Copper layers (1*16): Top 0.035mm / dielectric 1.5mm / Bottom 0.035mm
Design rules "SparkFun *": minimum track width 8mil, minimum drill 20mil, track to track 8mil, track to pad 8mil, pad to pad 8mil, via to via 8mil, smd to smd 8mil, copper to edge 8mil, drill to drill 8mil, minimum pad ring 12mil, minimum via ring 10mil, stop-mask expansion 4mil, vias tented up to drill 25mil, thermal gap 10mil

### Footprints (pad centres in the part's own frame; a part is rotated, then mirrored left to right if it is on the bottom)
6PIN_SMD = smd 0.94 x 2.1: 1 -6.35,5; 2 -3.81,5; 3 -1.27,5; 4 1.27,5; 5 3.81,5; 6 6.35,5 | hole 1.8: 5.08,0; -5.08,0
6PIN_PADS = smd 1.27 x 2.54: CLK -0.953,0; GND -4.763,0; GSCLK -2.857,0; LAT 0.953,0; SIN 2.857,0; SOUT 4.763,0
3PIN_HOLES = drill 0.9 pad 1.676: GND 2.54,0; SIG 0,0 | drill 0.9 pad 1.676 square: VCC -2.54,0
KB_RGBLED_APTF1616 = smd 0.5 x 0.7: P1 0.5,-0.8; P2 0.5,0.8; P3 -0.5,0.8; P4 -0.5,-0.8
56-HTSSOP = smd 0.3 x 1.55: P1 -7,-3.8; P2 -6.5,-3.8; P3 -6,-3.8; P4 -5.5,-3.8; P5 -5,-3.8; P6 -4.5,-3.8; P7 -4,-3.8; P8 -3.5,-3.8; P9 -3,-3.8; P10 -2.5,-3.8; P11 -2,-3.8; P12 -1.5,-3.8; P13 -1,-3.8; P14 -0.5,-3.8; P15 0,-3.8; P16 0.5,-3.8; P17 1,-3.8; P18 1.5,-3.8; P19 2,-3.8; P20 2.5,-3.8; P21 3,-3.8; P22 3.5,-3.8; P23 4,-3.8; P24 4.5,-3.8; P25 5,-3.8; P26 5.5,-3.8; P27 6,-3.8; P28 6.5,-3.8; P29 6.5,3.75; P30 6,3.75; P31 5.5,3.75; P32 5,3.75; P33 4.5,3.75; P34 4,3.75; P35 3.5,3.75; P36 3,3.75; P37 2.5,3.75; P38 2,3.75; P39 1.5,3.75; P40 1,3.75; P41 0.5,3.75; P42 0,3.75; P43 -0.5,3.75; P44 -1,3.75; P45 -1.5,3.75; P46 -2,3.75; P47 -2.5,3.75; P48 -3,3.75; P49 -3.5,3.75; P50 -4,3.75; P51 -4.5,3.75; P52 -5,3.75; P53 -5.5,3.75; P54 -6,3.75; P55 -6.5,3.75; P56 -7,3.75 | smd 4.699 x 3.607: P$1 0,0
2PIN_PADS_PWR = smd 3.81 x 5.08: GND 2.857,0; VCC -2.857,0

### Placement (x,y rotation side)
ARDUINO  25,1.65 0 top
FLANGE1  25.75,18.6 0 top
FLANGE2  55.85,25.7 90 top
FLANGE4  48.75,55.85 180 top
LED  11.5,29.65 0 top
LED00  21.56,21.51 0 top
LED01  21.86,25.66 0 top
LED02  22.06,29.61 0 top
LED03  22.18,33.44 0 top
LED04  22.22,37.21 0 top
LED05  22.18,40.98 0 top
LED06  22.06,44.81 0 top
LED07  21.86,48.76 0 top
LED08  21.56,52.91 0 top
LED09  25.71,21.81 0 top
LED10  25.93,25.88 0 top
LED11  26.08,29.76 0 top
LED12  26.17,33.51 0 top
LED13  26.2,37.21 0 top
LED14  26.17,40.9 0 top
LED15  26.08,44.66 0 top
LED16  25.93,48.54 0 top
LED17  25.71,52.61 0 top
LED18  29.66,22.01 0 top
LED19  29.81,26.03 0 top
LED20  29.91,29.86 0 top
LED21  29.96,33.56 0 top
LED22  29.98,37.21 0 top
LED23  29.96,40.85 0 top
LED24  29.91,44.56 0 top
LED25  29.81,48.39 0 top
LED26  29.66,52.4 0 top
LED27  33.49,22.13 0 top
LED28  33.56,26.12 0 top
LED29  33.61,29.91 0 top
LED30  33.64,33.59 0 top
LED31  33.65,37.21 0 top
LED32  33.64,40.83 0 top
LED33  33.61,44.5 0 top
LED34  33.56,48.3 0 top
LED35  33.49,52.28 0 top
LED36  37.26,22.17 0 top
LED37  37.26,26.15 0 top
LED38  37.26,29.93 0 top
LED39  37.26,33.6 0 top
LED40  37.26,37.21 0 top
LED41  37.26,40.82 0 top
LED42  37.26,44.48 0 top
LED43  37.26,48.27 0 top
LED44  37.26,52.24 0 top
LED45  41.03,22.13 0 top
LED46  40.95,26.12 0 top
LED47  40.9,29.91 0 top
LED48  40.88,33.59 0 top
LED49  40.87,37.21 0 top
LED50  40.88,40.83 0 top
LED51  40.9,44.5 0 top
LED52  40.95,48.3 0 top
LED53  41.03,52.28 0 top
LED54  44.86,22.01 0 top
LED55  44.71,26.03 0 top
LED56  44.61,29.86 0 top
LED57  44.55,33.56 0 top
LED58  44.53,37.21 0 top
LED59  44.55,40.85 0 top
LED60  44.61,44.56 0 top
LED61  44.71,48.39 0 top
LED62  44.86,52.4 0 top
LED63  48.81,21.81 0 top
LED64  48.59,25.88 0 top
LED65  48.44,29.76 0 top
LED66  48.35,33.51 0 top
LED67  48.32,37.21 0 top
LED68  48.35,40.9 0 top
LED69  48.44,44.66 0 top
LED70  48.59,48.54 0 top
LED71  48.81,52.61 0 top
LED72  52.96,21.51 0 top
LED73  52.66,25.66 0 top
LED74  52.45,29.61 0 top
LED75  52.33,33.44 0 top
LED76  52.29,37.21 0 top
LED77  52.33,40.98 0 top
LED78  52.45,44.81 0 top
LED79  52.66,48.76 0 top
LED80  52.96,52.91 0 top
T1  9.85,15.45 270 top
T2  20.05,66.2 0 top
T3  65.45,56.6 270 top
T4  55.6,9.25 180 top
T5  41.05,39.05 90 bottom
U$1  57.85,37.3 90 top
U$2  37.25,16.6 0 top
U$3  16.7,37.2 270 top
U$4  37.3,57.8 180 top
U$8  18.7,48.7 270 top

### Tracks (layer width: path | path; a pad name or v marks a point on that pad's centre or on a via)
3.3V  (via drill 0.33)  (42 unrouted)
  Top 0.3: LED59.P1 45.05,39.65 45.1,39.65 46.45,38.3 47,38.3 47.3,38 47.3,36.25 | 47.3,36.25 47.3,35.6 | 47.3,35.6 48.3,35.6 48.5,35.8 48.5,36.09 LED67.P1 | LED66.P1 48.8,33.25 48.8,33.3 47.3,33.3 47.3,35.6 | LED32.P1 34.28,40.03 35.1,40.85 35.1,41.75 34.15,42.7 34.15,43.66 LED33.P1 34.11,44.01 34.65,44.55 34.65,46.91 LED34.P1 | LED41.P1 39.18,40.02 39.9,39.3 41.3,39.3 | 41.3,39.3 42.2,39.3 42.3,39.2 42.3,37.34 | 42.3,37.34 LED49.P1 | LED50.P1 41.38,39.38 41.3,39.3 | 42.3,37.34 42.3,35.95 v41.9,35.55 | LED48.P1 41.8,32.37 v42.95,32.25 43.6,33.4 44.4,33.4 44.99,32.76 LED57.P1 | LED58.P1 47.14,36.41 47.3,36.25 | LED68.P1 48.85,40.45 49.55,41.15 49.55,42.15 49.9,42.5 49.9,43.4 49.6,43.7 49.1,43.7 LED69.P1 | LED77.P1 53.02,40.18 53.5,39.7 53.5,37.35 53.55,37.3 53.55,37.17 LED76.P1 | LED51.P1 42.75,43.7 43.25,44.2 43.25,44.65 | 43.25,44.65 43.25,45.75 42.75,46.25 | LED60.P1 45.09,43.76 44.25,44.6 43.3,44.6 43.25,44.65
  Top 2: U$1.VCC 72.71,34.44 v73.05,34.4 | U$4.VCC v40.16,72.89 v40.15,72.9 | U$3.VCC 2.09,40.06 v2.05,40.1 | U$2.VCC v34.39,1.96 v34.4,1.95
  Bottom 0.3: v41.9,35.55 41.9,35.3 41.7,35.1 41.65,32.35 v42.95,32.25 43.85,33.05 T5.P54
  Bottom 2: 34.45,1.95 73.05,1.95 v73.05,34.4 73.1,35 72.95,73.3 40.3,73.15 | 34.45,1.95 v34.4,1.95 | v40.15,72.9 40.3,73.15 | 40.3,73.15 40.15,73.3 2.15,73.3 2.05,72.9 v2.05,40.1 2.05,1.95 15.65,1.95 18.45,4.75 34.1,4.75 34.3,4.95 34.3,2.1 34.45,1.95 | 34.45,1.95 34.5,1.9 34.5,1.85 34.4,1.75 34.4,1.9 34.45,1.95 | 34.45,1.95 34.45,2.05 34.5,2.1
GND  (via drill 0.33)  (16 unrouted)
  Top 1: FLANGE2.GND 67.59,20.94 v67.6,20.95 | U$8.GND 6.09,53.46 v5.95,53.8 | v54.3,59.05 53.51,58.26 FLANGE4.GND | FLANGE1.GND 20.99,14.61 v21,14.6 | v17.75,7.95 17.75,7.55 ARDUINO.1
  Top 2: U$4.GND 34.44,69.94 v34.45,69.65 | U$1.GND 68.84,40.16 v69,40 | U$2.GND 40.11,5.29 v40.15,5.75 | U$3.GND 5.89,34.34 5.75,34.2
  Bottom 0.3: T5.P56 44.8,30.9 43.85,30.9 43.55,30.6 43.2,30.6 43.1,30.5 43.1,30 42.95,29.85 41.2,29.85 41.05,29.7
  Bottom 0.5: T5.P$1 41.05,29.7 41.05,28.3
  Bottom 1: v67.6,20.95 69,20.95 | v54.3,59.05 54.3,68.7 53.5,69.5 | v44.45,69.75 44.45,69.95 44.8,70 43.55,70.15 43,69.6 | v21,14.6 21,7.95
  Bottom 2: v34.45,69.65 5.8,69.7 5.75,69.55 v5.95,53.8 5.95,5.6 15.4,5.6 v17.75,7.95 21,7.95 39.81,7.95 40.11,8.25 40.11,5.79 v40.15,5.75 69,5.95 69.1,6.05 69,20.95 v69,40 69,69.6 69.15,69.55 53.5,69.5 v44.45,69.75 43,69.6 34.85,69.75 34.5,70.1
GSCLK  (via drill 0.33)  (8 unrouted)
  Top 0.3: v42.25,30.5 42.25,28.65
  Top 1: ARDUINO.2 21.19,7.54 22.8,9.15 22.8,18.51 FLANGE1.GSCLK
  Bottom 0.3: T5.P55 44,32.55 43.8,32.35 43.8,32.25 43.7,32.15 43.7,31.5 43.25,31.05 42.8,31.05 v42.25,30.5
LAT  (8 unrouted)
  Top 1: FLANGE1.LAT 26.7,8.3 26.3,7.9 26.3,6.68 ARDUINO.4
N$1  (via drill 0.33)
  Top 0.3: LED40.P2 38.04,38.01 38.75,37.3 38.75,35.7 39.25,35.35 39.45,35.2 39.65,34.8 39.65,34.2 v39.55,34.1
  Bottom 0.3: 39.15,34.05 39.2,34.1 v39.55,34.1 39.5,34.05 T5.P5
N$2  (via drill 0.33)
  Top 0.3: LED40.P3 36.76,37.84 37.35,37.25 38.05,37.25 38.3,37 38.3,35.1 v38.7,34.7 38.8,34.6
  Bottom 0.3: T5.P6 38.55,34.55 v38.7,34.7
N$3  (via drill 0.33)
  Top 0.3: LED40.P4 36.36,36.41 36.05,36.1 36.05,33.1 v35.75,32.55
  Bottom 0.3: T5.P4 36.1,33.55 36.05,33.5 36.05,32.85 v35.75,32.55
N$4  (via drill 0.33)
  Top 0.3: v30.4,31.7 30.8,31.7 31.25,32.15 31.25,33.57 LED21.P2
  Bottom 0.3: T5.P8 35.45,35.55 35.05,35.15 35.05,33.7 32.85,31.5 30.6,31.5 v30.4,31.7
N$5  (via drill 0.33)
  Top 0.3: v29.85,35.25 29.85,34.75 LED21.P3
  Bottom 0.3: T5.P9 35.3,36.05 34.55,35.3 34.55,33.85 32.7,32 31.6,32 31.3,32.3 31.25,32.3 30.1,33.45 30.1,35 v29.85,35.25
N$6  (via drill 0.33)
  Top 0.3: v29.15,31.75 29.15,32.45 LED21.P4
  Bottom 0.3: T5.P7 35.7,35.05 35.55,34.9 35.55,33.45 34.3,32.2 34.25,32.2 32.9,30.85 29.75,30.85 29.25,31.35 29.25,31.65 v29.15,31.75
N$7  (via drill 0.33)
  Top 0.3: v32.05,33.75 32.55,33.75 32.7,33.6 33.85,33.6 34.1,33.85 34.1,34.35 LED30.P2
  Bottom 0.3: T5.P11 35,37.05 34.95,37 34.8,37 33.4,35.6 33.4,34.3 33,33.9 32.2,33.9 v32.05,33.75
N$8  (via drill 0.33)
  Top 0.3: v32.05,34.85 32.68,34.85 LED30.P3
  Bottom 0.3: T5.P12 34.65,37.55 32.9,35.8 32.9,35 32.25,35 v32.05,34.85
N$9  (via drill 0.33)
  Top 0.3: v32.05,32.75 33.1,32.75 LED30.P4
  Bottom 0.3: T5.P10 35.1,36.55 33.95,35.4 33.95,33.9 33.6,33.55 33.55,33.55 32.65,32.65 32.15,32.65 v32.05,32.75
N$10  (via drill 0.33)
  Top 0.3: LED31.P2 34.15,37.7 33.65,37.2 32.2,37.2 v32.05,37
  Bottom 0.3: v32.05,37 33.6,38.55 T5.P14
N$11  (via drill 0.33)
  Top 0.3: v32.05,38.05 33.11,38.05 LED31.P3
  Bottom 0.3: v32.05,38.05 32.5,38.5 32.85,38.55 33.4,39.1 33.45,39.05 T5.P15
N$12  (via drill 0.33)
  Top 0.3: LED31.P4 32.61,36.41 v32.05,35.95
  Bottom 0.3: v32.05,35.95 32.15,35.9 33.65,37.4 33.65,37.45 34.25,38.05 T5.P13
N$13  (via drill 0.33)
  Top 0.3: LED32.P2 34.14,41.29 33.65,40.8 32.45,40.8 v32.05,40.35
  Bottom 0.3: v32.05,40.35 32.45,40.35 32.75,40.05 T5.P17
N$14  (via drill 0.33)
  Top 0.3: v32.05,41.5 33.01,41.5 LED32.P3
  Bottom 0.3: T5.P18 33.05,40.55 v32.05,41.5
N$15  (via drill 0.33)
  Top 0.3: v32.05,39.2 32.36,39.25 LED32.P4
  Bottom 0.3: T5.P16 33.25,39.55 32.75,39.05 32.3,39 v32.05,39.2
N$16  (via drill 0.33)
  Top 0.3: v32.35,44.55 33.36,44.55 LED33.P2
  Bottom 0.3: T5.P20 34.25,41.55 33.6,42.2 33.6,43.3 v32.35,44.55
N$17  (via drill 0.33)
  Top 0.3: v33.5,46.45 33.5,45.69 LED33.P3
  Bottom 0.3: T5.P21 34.65,42.05 34.15,42.55 34.15,43.9 33.95,44.1 33.95,46 v33.5,46.45
N$18  (via drill 0.33)
  Top 0.3: LED33.P4 33.11,43.36 v32.55,42.8
  Bottom 0.3: v32.55,42.8 32.55,42.35 33.85,41.05 T5.P19
N$19  (via drill 0.33)
  Top 0.3: LED34.P2 34.8,49.1 v35,48.9
  Bottom 0.3: v35,48.9 35,47.05 34.6,46.65 34.6,44.4 35.95,43.05 T5.P23
N$20  (via drill 0.33)
  Top 0.3: v33.45,50.15 33.45,49.49 LED34.P3
  Bottom 0.3: T5.P24 36.2,43.55 35.1,44.65 35.1,46.35 35.5,46.75 35.5,46.9 35.7,47.1 35.7,49.6 35.35,49.95 33.65,49.95 v33.45,50.15
N$21  (via drill 0.33)
  Top 0.3: v35.1,42.95 35.1,47.75 34.6,48.2 33.76,48.2 LED34.P4
  Bottom 0.3: T5.P22 35.45,42.55 v35.1,42.95
N$22  (via drill 0.33)
  Top 0.3: 41.37,38.13 LED49.P2 41.35,38.03 41.35,38.6 41.3,38.65 39.75,38.65 39.25,39.15 36.4,39.15 36.1,39.45 36.1,45.55 v35.85,45.8
  Bottom 0.3: v35.85,45.8 35.85,44.8 36.1,44.55 T5.P26
N$23  (via drill 0.33)
  Top 0.3: v39.6,45.05 39.6,44 v39.05,43.5 | v39.45,36.1 39.45,37.09 LED49.P3
  Bottom 0.3: T5.P27 v39.6,45.05 | v39.05,43.5 39.05,43.15 38.9,43 38.9,36.45 v39.45,36.1
N$24  (via drill 0.33)
  Top 0.3: v40.25,35.4 40.35,35.74 LED49.P4
  Bottom 0.3: T5.P25 38.25,44.05 38.3,44 38.3,35.85 38.85,35.3 39.95,35.3 v40.25,35.4
N$25  (via drill 0.33)  (4 unrouted)
  Top 0.3: LED48.P4 40.38,31.78 40.35,31.75 41.95,31.75 42.15,31.55 43.35,31.55 43.55,31.75 46.05,31.75 v46.35,31.45
  Bottom 0.3: v46.35,31.45 46.35,31.75 46.25,31.75 46,32 46,33.3 45.75,33.55 T5.P53
N$26  (via drill 0.33)
  Top 0.3: LED48.P3 40.38,33.63 40.35,33.6 40.15,33.6 39.8,33.25 39.8,31.3 41.75,31.3 41.95,31.1 43.5,31.1 43.7,31.3 45.55,31.3 45.65,31.2 45.65,30.85 46.05,30.45 46.95,30.45 v47.05,30.55
  Bottom 0.3: T5.P51 45.75,34.55 45.95,34.35 45.95,33.95 46.4,33.5 46.4,32.4 46.6,32.2 46.65,32.2 47.05,31.8 v47.05,30.55
N$27  (via drill 0.33)
  Top 0.3: v42.4,33.05 42.4,33.4 42.05,33.7 42.05,34 41.95,34.1 41.67,34.1 LED48.P2
  Bottom 0.3: T5.P52 43.8,34.05 43.75,34 43.75,33.5 43.6,33.35 43.4,33.35 43.05,33 42.4,33 v42.4,33.05
N$28  (via drill 0.33)
  Top 0.3: v46.1,35.1 45.55,35.65 44.3,35.65 44.25,35.7 44.25,36.19 LED58.P4
  Bottom 0.3: T5.P50 45.95,35.05 v46.1,35.1
N$29  (via drill 0.33)
  Top 0.3: LED58.P3 42.86,38.01 42.8,37.95 42.8,35 v42.5,34.7
  Bottom 0.3: v42.5,34.7 42.5,34.9 42.85,35.25 42.85,35.9 | 42.85,35.9 42.75,36 | T5.P48 43,36.05 42.85,35.9
N$30  (via drill 0.33)
  Top 0.3: LED58.P2 45.03,37.33 45,37.3 43.35,37.3 43.3,37.25 43.3,35.65 43.35,35.6 43.35,34.4 v43,33.85
  Bottom 0.3: v43,33.85 43,34 43.35,34.35 43.35,35.35 43.55,35.55 T5.P49
N$31  (via drill 0.33)
  Top 0.3: v49.55,39.45 48.35,39.45 48.35,39.6 LED68.P4
  Bottom 0.3: T5.P47 45.6,36.55 46.9,35.25 48.45,35.25 49.5,36.3 49.5,39.4 v49.55,39.45
N$32  (via drill 0.33)
  Top 0.3: v48,42.85 48,42.15 LED68.P3
  Bottom 0.3: T5.P45 45.75,37.55 46.85,36.45 47.05,36.3 47.5,36.3 48.35,36.8 48.2,42.5 v48,42.85
N$33  (via drill 0.33)
  Top 0.3: v49.1,42.85 LED68.P2
  Bottom 0.3: T5.P46 45.7,37.05 46.55,36.15 46.85,35.85 47.85,35.85 48.8,36.45 48.8,40.95 v49.1,42.85
N$34  (via drill 0.33)
  Top 0.3: v46.6,37.65 45.4,38.7 44.85,38.7 44.5,39.05 44.5,39.6 LED59.P4
  Bottom 0.3: T5.P44 46.05,38.05 v46.6,37.65
N$35  (via drill 0.33)
  Top 0.3: LED59.P3 44.05,41.35 44.35,41.05 46.1,41.05 46.9,40.6 46.9,39.55 v46.55,39.15
  Bottom 0.3: v46.55,39.15 46.2,39.05 T5.P42
N$36  (via drill 0.33)
  Top 0.3: LED50.P4 40.38,40.23 40.75,40.6 41.9,40.6 42,40.5 42.1,40.5 42.6,40 42.75,40 v43.4,39.2
  Bottom 0.3: v43.4,39.2 43.65,39.5 44.75,39.5 T5.P41
N$37  (via drill 0.33)
  Top 0.3: LED50.P3 41.55,42.8 42.9,42.8 43.35,42.35 46.1,42.35 v46.6,42.15
  Bottom 0.3: T5.P39 45.7,40.55 46.4,41.2 46.65,41.95 v46.6,42.15
N$38  (via drill 0.33)
  Top 0.3: LED50.P2 41.93,41.63 v42.25,41.95
  Bottom 0.3: v42.25,41.95 42.6,41.95 43.25,41.3 43.25,40.25 43.45,40.05 T5.P40
N$39  (via drill 0.33)
  Top 0.3: v46.2,40.1 46.2,40.15 46.1,40.15 45.85,40.55 45.65,40.65 42.6,40.65 42.15,41.05 38.15,41.05 37.75,40.65 37.39,40.65 LED41.P4
  Bottom 0.3: T5.P38 45.65,41.05 45.9,41.4 45.9,42.5 46.25,42.85 46.9,42.85 47.3,42.45 47.3,40.2 47.2,40.15 46.85,39.85 v46.2,40.1
N$40  (via drill 0.33)
  Top 0.3: v40.4,42.75 40.1,42.55 39.85,42.8 39.25,42.8 38.9,42.45 37.59,42.45 LED41.P3
  Bottom 0.3: T5.P36 44,42.05 43.9,42.15 43.8,42.1 42.85,43.05 40.65,43.05 v40.4,42.75
N$41  (via drill 0.33)
  Top 0.3: v39.55,42 38.09,42 LED41.P2
  Bottom 0.3: T5.P37 43.7,41.55 42.6,42.65 42,42.65 41.4,42 41.4,41.75 39.8,41.75 v39.55,42
N$42  (via drill 0.33)
  Top 0.3: v43.85,46.3 44.8,46.3 45,46.1 45,45.47 LED60.P2
  Bottom 0.3: T5.P35 44,42.55 43.15,43.4 43.1,43.4 42.95,43.55 42.25,43.55 40.2,45.6 40.2,45.7 40.15,45.75 40.15,46.8 43.35,46.8 v43.85,46.3
N$43  (via drill 0.33)
  Top 0.3: v46.2,44.6 45.07,44.6 LED60.P3
  Bottom 0.3: T5.P33 45.65,43.55 45.9,43.8 45.9,44.15 v46.2,44.6
N$44  (via drill 0.33)
  Top 0.3: LED60.P4 44.11,43.74 T5.P34 46,43.05 v46.6,43.65
  Bottom 0.3: v46.6,43.65 46.35,43.65 45.75,43.05 T5.P34
N$45  (via drill 0.33)
  Top 0.3: LED51.P4 40.4,43.9 40.95,44.45 42.15,44.45 v42.35,44.65
  Bottom 0.3: v42.35,44.65 42.35,44.4 42.75,44 44.75,44 T5.P32
N$46  (via drill 0.33)
  Top 0.3: LED51.P3 40.4,45.65 v40.9,46.15
  Bottom 0.3: v40.9,46.15 41.3,46.15 41.55,46.4 42.6,46.4 43.3,45.7 43.3,45.55 43.65,45.2 43.65,45.05 T5.P30
N$47  (via drill 0.33)
  Top 0.3: LED51.P2 41.75,45.3 v42.15,45.7
  Bottom 0.3: v42.15,45.7 42.45,45.7 43.25,44.9 43.25,44.55 T5.P31
N$49  (1 unrouted)
N$50  (1 unrouted)
N$51  (1 unrouted)
N$52  (1 unrouted)
N$53  (1 unrouted)
N$54  (1 unrouted)
N$55  (1 unrouted)
N$95  (1 unrouted)
N$96  (1 unrouted)
N$97  (1 unrouted)
N$98  (1 unrouted)
N$99  (1 unrouted)
N$100  (1 unrouted)
N$101  (1 unrouted)
N$102  (1 unrouted)
N$103  (1 unrouted)
N$104  (1 unrouted)
N$105  (1 unrouted)
N$106  (1 unrouted)
N$107  (1 unrouted)
N$108  (1 unrouted)
N$109  (1 unrouted)
N$110  (1 unrouted)
N$111  (1 unrouted)
N$112  (1 unrouted)
N$113  (1 unrouted)
N$114  (1 unrouted)
N$115  (1 unrouted)
N$116  (1 unrouted)
N$117  (1 unrouted)
N$118  (1 unrouted)
N$119  (1 unrouted)
N$120  (1 unrouted)
N$121  (1 unrouted)
N$122  (1 unrouted)
N$123  (1 unrouted)
N$124  (1 unrouted)
N$125  (1 unrouted)
N$126  (1 unrouted)
N$127  (1 unrouted)
N$128  (1 unrouted)
N$129  (1 unrouted)
N$130  (1 unrouted)
N$131  (1 unrouted)
N$132  (1 unrouted)
N$133  (1 unrouted)
N$134  (1 unrouted)
N$135  (1 unrouted)
N$136  (1 unrouted)
N$137  (1 unrouted)
N$138  (1 unrouted)
N$139  (1 unrouted)
N$140  (1 unrouted)
N$141  (1 unrouted)
N$142  (1 unrouted)
N$143  (1 unrouted)
N$144  (1 unrouted)
N$145  (1 unrouted)
N$146  (1 unrouted)
N$147  (1 unrouted)
N$148  (1 unrouted)
N$149  (1 unrouted)
N$150  (1 unrouted)
N$151  (1 unrouted)
N$152  (1 unrouted)
N$153  (1 unrouted)
N$154  (1 unrouted)
N$155  (1 unrouted)
N$156  (1 unrouted)
N$157  (1 unrouted)
N$158  (1 unrouted)
N$159  (1 unrouted)
N$160  (1 unrouted)
N$161  (1 unrouted)
N$162  (1 unrouted)
N$163  (1 unrouted)
N$164  (1 unrouted)
N$165  (1 unrouted)
N$166  (1 unrouted)
N$167  (1 unrouted)
  Top 0.3: LED35.P4 32.42,51.48 30.75,53.15 30.75,55.4 30.55,55.6
N$168  (1 unrouted)
  Top 0.3: LED35.P3 32.07,53.08 31.65,53.5 31.65,55.75 31.5,55.9
N$169  (1 unrouted)
  Top 0.3: LED35.P2 33.99,52.99 33.35,52.35 32.2,52.35 31.2,53.35 31.2,55.6 31,55.8
N$170  (1 unrouted)
N$171  (1 unrouted)
N$172  (1 unrouted)
N$173  (1 unrouted)
N$174  (1 unrouted)
N$175  (1 unrouted)
N$176  (1 unrouted)
N$177  (1 unrouted)
N$178  (1 unrouted)
N$179  (1 unrouted)
N$180  (1 unrouted)
N$181  (1 unrouted)
N$182  (1 unrouted)
N$183  (1 unrouted)
N$184  (1 unrouted)
N$185  (1 unrouted)
N$186  (1 unrouted)
N$187  (1 unrouted)
N$188  (1 unrouted)
N$189  (1 unrouted)
N$190  (1 unrouted)
N$191  (1 unrouted)
N$192  (1 unrouted)
N$193  (1 unrouted)
N$194  (1 unrouted)
N$195  (via drill 0.33)  (1 unrouted)
  Top 0.3: LED42.P2 37.76,46.29 v37.55,46.5
  Bottom 0.3: v37.55,46.5 37.25,46.5 36.2,47.55 36.2,49.75 35.5,50.45 35.5,50.8 34.7,51.6 34.3,51.6 33.05,52.85 33,52.85 32.85,53 31.6,53 31.2,53.4 31.2,55.65 31.45,55.9
N$196  (via drill 0.33)  (1 unrouted)
  Top 0.3: LED42.P3 36.76,46.19 36.4,46.55 36.15,46.55 35.85,46.85 35.85,49.4 35.35,49.9 35.3,49.9 v34.5,50.7
  Bottom 0.3: v34.5,50.7 32.65,52.55 31.45,52.55 30.75,53.25 30.75,55.85 31.15,56.25
N$197  (via drill 0.33)  (2 unrouted)
  Top 0.3: LED42.P4 36.76,43.81 37.35,44.4 38,44.4 38.4,44.7 38.4,45.55 38.95,46.2 38.95,46.3 v38.65,46.6
  Bottom 0.3: v38.65,46.6 38.65,46.8 38.25,47.2 37.4,47.2 36.75,47.85 36.75,49.9 36,50.65 36,51 34.95,52.05 34.55,52.05 33.2,53.4 31.8,53.4 31.65,53.55 31.65,55.45 32.85,55.45 33.35,55.95
N$198  (1 unrouted)
N$199  (1 unrouted)
N$200  (1 unrouted)
N$201  (1 unrouted)
N$202  (1 unrouted)
N$203  (1 unrouted)
N$204  (1 unrouted)
N$205  (1 unrouted)
N$206  (1 unrouted)
N$207  (1 unrouted)
N$208  (1 unrouted)
N$209  (1 unrouted)
N$210  (1 unrouted)
N$211  (1 unrouted)
N$212  (1 unrouted)
N$213  (1 unrouted)
N$214  (1 unrouted)
N$215  (1 unrouted)
N$216  (1 unrouted)
N$217  (1 unrouted)
N$218  (1 unrouted)
N$219  (1 unrouted)
N$220  (1 unrouted)
N$221  (1 unrouted)
N$222  (1 unrouted)
N$223  (1 unrouted)
N$224  (via drill 0.33)  (1 unrouted)
  Top 0.3: LED77.P4 51.83,40.62 51.1,41.35 51.1,42.5 v51.45,42.85 | v55.55,45.1 55.65,45.1 56.95,46.4 59.35,46.4
  Bottom 0.3: v51.45,42.85 51.45,43 52.2,43.75 52.3,43.75 53.4,44.85 55.3,44.85 v55.55,45.1
N$225  (1 unrouted)
  Top 0.3: LED77.P3 51.83,41.93 53.45,43.55 55.05,43.55 57.15,45.65 57.15,45.7 57.35,45.9 59.3,45.9
N$226  (1 unrouted)
  Top 0.3: LED77.P2 53.4,42.35 53.4,42.75 53.75,43.1 55.25,43.1 57.35,45.2 57.65,45.2 57.85,45.4 59.5,45.4 59.55,45.45
N$227  (1 unrouted)
N$228  (1 unrouted)
N$229  (1 unrouted)
N$230  (via drill 0.33)  (1 unrouted)
  Top 0.3: LED76.P4 51.79,36.29 v51.05,35.55 | v57.1,43.75 58.4,43.75 58.45,43.7
  Bottom 0.3: v51.05,35.55 51.1,35.55 52.05,36.85 52.05,39.5 52.9,40.1 52.9,42.95 53.7,43.75 v57.1,43.75
N$231  (via drill 0.33)  (1 unrouted)
  Top 0.3: LED76.P3 51.79,37.64 v50.85,36.55 | v58.05,44.55 59,44.55 59.05,44.5
  Bottom 0.3: v50.85,36.55 51,37.45 51.55,38.15 51.55,39.65 52.4,40.35 52.4,43.2 52.95,43.75 53,43.75 53.55,44.3 56.5,44.3 56.8,44.6 58,44.6 v58.05,44.55
N$232  (via drill 0.33)  (1 unrouted)
  Top 0.3: LED76.P2 52.69,38.59 v52.8,39.05 | v56.25,42.9 57.4,42.9 57.45,42.95
  Bottom 0.3: v52.8,39.05 53,39.6 53.4,39.75 53.4,42.7 53.85,43.15 56,43.15 v56.25,42.9
N$233  (via drill 0.33)  (3 unrouted)
  Top 0.3: LED67.P4 47.82,36.57 48.35,37.1 49.95,37.1 v50.25,37.55
  Bottom 0.3: v50.25,37.55 50.25,37.5 50.95,38.2 50.95,39.95 51.15,40.15 51.15,40.4 50.6,40.95 50.6,43.65
N$234  (via drill 0.33)  (3 unrouted)
  Top 0.3: LED67.P3 47.82,38.07 48.5,38.75 49.95,38.75 50.3,39.1 50.3,40 v49.85,40.45
  Bottom 0.3: v49.85,40.45 49.85,42.55 49.9,42.6 49.9,43.9
N$235  (1 unrouted)
  Top 0.3: LED67.P2 49.31,38.01 49.55,38.25 50.1,38.25 51.05,39.2 51.05,40.45 50.4,41.1 50.4,42.95 50.95,43.5
N$283  (1 unrouted)
N$284  (1 unrouted)
N$285  (1 unrouted)
N$286  (via drill 0.33)  (1 unrouted)
  Top 0.3: LED57.P2 46.69,34.36 v46.65,34.3
  Bottom 0.3: v46.65,34.3 49.45,34.35 49.5,34.3
N$287  (1 unrouted)
  Top 0.3: LED57.P3 44.09,34.36 44.7,33.75 44.8,33.75 45.1,33.45 45.55,33.45 45.65,33.35 45.65,33 46,32.65 46.8,32.65 47.7,31.75 49.5,31.75 49.55,31.7
N$288  (1 unrouted)
  Top 0.3: LED57.P4 44.05,32.3 44.2,32.15 46.1,32.15 46.15,32.2 46.65,32.2 47.05,31.8 47.05,31.35 47.1,31.3 49.45,31.3 49.55,31.2
N$289  (1 unrouted)
N$290  (1 unrouted)
N$291  (1 unrouted)
N$292  (1 unrouted)
N$293  (1 unrouted)
N$294  (1 unrouted)
N$295  (1 unrouted)
N$296  (1 unrouted)
N$297  (1 unrouted)
N$298  (1 unrouted)
N$299  (1 unrouted)
N$300  (1 unrouted)
N$301  (1 unrouted)
N$302  (1 unrouted)
N$303  (1 unrouted)
N$304  (1 unrouted)
N$305  (1 unrouted)
N$306  (1 unrouted)
N$307  (1 unrouted)
N$308  (1 unrouted)
N$309  (1 unrouted)
N$310  (1 unrouted)
N$311  (1 unrouted)
N$312  (1 unrouted)
N$313  (1 unrouted)
N$314  (1 unrouted)
N$315  (1 unrouted)
N$316  (1 unrouted)
  Top 0.3: LED66.P4 47.85,32.5 48.2,32.15 49.8,32.15
N$317  (1 unrouted)
  Top 0.3: LED66.P3 48.45,33.7 49.15,33.7 49.75,33.1
N$318  (1 unrouted)
N$319  (1 unrouted)
N$320  (1 unrouted)
N$321  (1 unrouted)
N$322  (1 unrouted)
N$323  (1 unrouted)
N$324  (1 unrouted)
N$325  (1 unrouted)
N$326  (1 unrouted)
N$327  (1 unrouted)
N$328  (1 unrouted)
N$329  (1 unrouted)
N$357  (1 unrouted)
  Bottom 0.25: 38.5,45.7 39,45.7 39.55,46.25 39.55,46.7 38.3,47.95
  Bottom 0.3: T5.P28 38.35,45.55 38.5,45.7
N$360  (1 unrouted)
N$361  (1 unrouted)
N$362  (1 unrouted)
N$363  (1 unrouted)
N$364  (1 unrouted)
N$365
  Top 0.25: 28.8,4.55 1.15,4.55 0.75,4.95 0.75,22.6 0.9,22.45 T1.P1
  Top 1: ARDUINO.5 28.81,4.56 28.8,4.55
N$370  (via drill 0.33)
  Top 0.3: LED59.P2 46.15,41.65 46.35,41.45 46.7,41.45 46.95,41.4 47.35,40.85 47.35,39.45 47.65,39.1 v47.6,39.05
  Bottom 0.3: T5.P43 46.05,38.6 46.3,38.35 46.9,38.35 v47.6,39.05
N$372  (1 unrouted)
N$373  (1 unrouted)
N$374  (15 unrouted)
N$375  (1 unrouted)
N$384  (14 unrouted)
  Top 0.3: LED42.P1 37.98,43.68 38.85,44.55 38.85,45.35 39.4,46.05 39.4,47.15 39.5,47.25 39.5,47.35 39.3,47.55 37.84,47.55 LED43.P1
SCLK  (8 unrouted)
  Top 1: FLANGE1.CLK 24.8,8.8 23.75,7.75 23.75,6.67 ARDUINO.3